# Altium schematic sheet KT1025A.SchDoc
size A4
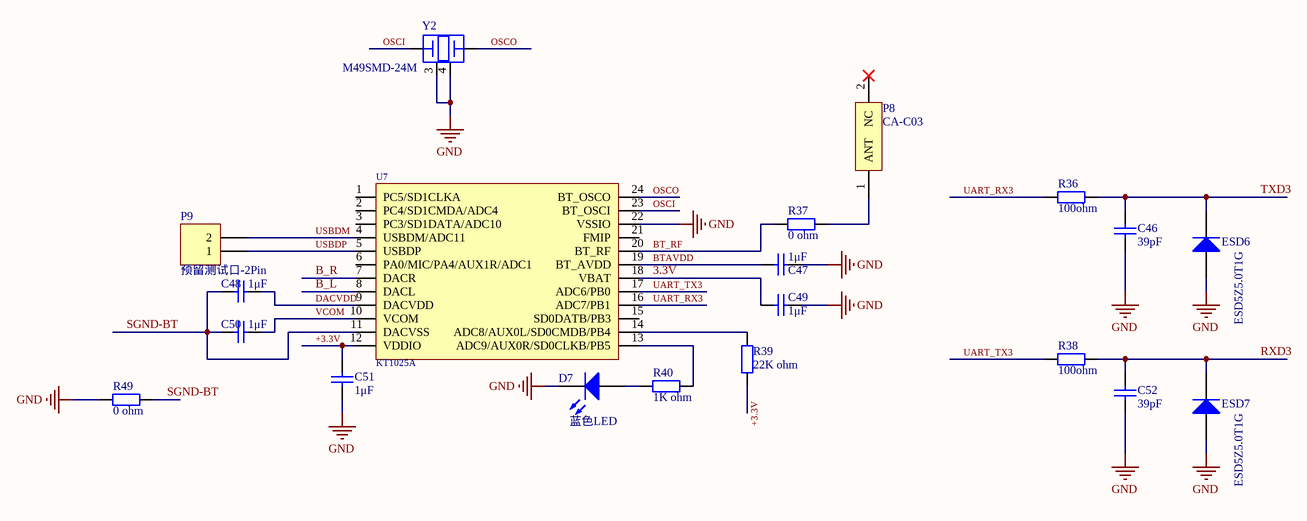
[diagram p0: KT1025A.SchDoc]

## Parts
C46  39pF  [0603C]
C47  1μF  [0603C]
C48  1μF  [0603C]
C49  1μF  [0603C]
C50  1μF  [0603C]
C51  1μF  [0603C]
C52  39pF  [0603C]
D7  蓝色LED  [0603LED]
ESD6  ESD5Z5.0T1G  [SOD523]
ESD7  ESD5Z5.0T1G  [SOD523]
P8  CA-C03  [ANT]
P9  预留测试口-2Pin  [预留测试口 2Pin]
R36  100ohm  [0603R]
R37  0 ohm  [0603R]
R38  100ohm  [0603R]
R39  22K ohm  [0603R]
R40  1K ohm  [0603R]
R49  0 ohm  [0805R]
U7  KT1025A  [SSOP24]
Y2  M49SMD-24M  [M49S]

## Nets
GND: C46.1 C47.2 C49.2 C51.1 C52.1 D7.2(K) ESD6.1(A) ESD7.1(A) R49.1 U7.22(VSSIO) Y2.3 Y2.4
3.3V: C49.1 U7.18(VBAT)
+3.3V: C51.2 R39.1 U7.12(VDDIO)
B_L: U7.8(DACL)
B_R: U7.7(DACR)
BT_RF: R37.1 U7.20(BT_RF)
BTAVDD: C47.1 U7.19(BT_AVDD)
DACVDD: C48.2 U7.9(DACVDD)
OSCI: U7.23(BT_OSCI) Y2.1
OSCO: U7.24(BT_OSCO) Y2.2
RXD3: C52.2 ESD7.2(K) R38.2
SGND-BT: C48.1 C50.1 R49.2 U7.11(DACVSS)
TXD3: C46.2 ESD6.2(K) R36.2
UART_RX3: R36.1 U7.16(ADC7/PB1)
UART_TX3: R38.1 U7.17(ADC6/PB0)
USBDM: P9.2 U7.4(USBDM/ADC11)
USBDP: P9.1 U7.5(USBDP)
VCOM: C50.2 U7.10(VCOM)
NetD7_1: D7.1(A) R40.2
NetP8_1: P8.1(ANT) R37.2
NetR39_2: R39.2 U7.14(ADC8/AUX0L/SD0CMDB/PB4)
NetR40_1: R40.1 U7.13(ADC9/AUX0R/SD0CLKB/PB5)

Not connected (* = marked no-connect by the designer): P8 2(NC)*; U7 1(PC5/SD1CLKA) 2(PC4/SD1CMDA/ADC4) 3(PC3/SD1DATA/ADC10) 6(PA0/MIC/PA4/AUX1R/ADC1) 15(SD0DATB/PB3) 21(FMIP)

## Library data of the parts
C46 C52 = Cap_39pF_50V_0603: 39pF_50V,C0G (EIA),±1%; 物料名称: 贴片陶瓷电容; 制造商: muRata; 物料编码: NA; 物料型号: GCM1885C1H390FA16; 单位: PCS; 物料规格: 39pF_50V,C0G (EIA),±1%
C47-C51 = Cap_1μF_50V_0603: 1μF_50V,X5R,±10%; 物料名称: 贴片陶瓷电容; 制造商: muRata; 物料编码: TCC0040; 物料型号: GRM188R61H105KAALD; 单位: PCS; 物料规格: 1μF_50V,X5R,±10%
D7 = 蓝色LED: 物料规格: LED(蓝色）; 制造商: VISHAY; 物料编码: TRG0035; 物料型号: TLMB1100; 单位: PCS; 物料名称: LED(蓝色）
ESD6 ESD7 = ESD5Z5.0T1G_SOD523: 物料名称: ESD二极管; 制造商: 安森美; 物料编码: NA; 单位: PCS; 物料规格: ESD5Z5.0T1G; 物料型号: ESD5Z5.0T1G
P8 = CA-C03: 物料名称: 蓝牙天线; 制造商: 寒武纪电子; 物料编码: NA; 单位: PCS; 物料规格: CA-C03; 物料型号: CA-C03
P9 = 预留测试口-2Pin: 制造商: NA; 单位: PCS; 物料规格: 预留测试口-2Pin; 物料名称: 预留测试口-2Pin; 物料编码: NA; 物料型号: 预留测试口-2Pin
R36 R38 = Res_100ohm_0603: 100 ohm_5%; 物料名称: 贴片电阻; 制造商: YAGEO; 物料编码: TRS0010; 物料型号: RC0603JR-07100R; 单位: PCS; 物料规格: 100 ohm_5%
R37 = Res_0 ohm_0603: 0 ohm,5%; 物料名称: 贴片电阻; 制造商: YAGEO; 物料编码: TRS0003; 物料型号: RC0603JR-070RL; 单位: PCS; 物料规格: 0 ohm,5%
R39 = Res_22K ohm_0603: 22K ohm,1%; 物料名称: 贴片电阻; 制造商: YAGEO; 物料编码: NA; 物料型号: RC0603FR-0722KL; 单位: PCS; 物料规格: 22K ohm,1%
R40 = Res_1K ohm_0603: 1K ohm,1%; 物料名称: 贴片电阻; 制造商: YAGEO; 物料编码: TRS0043; 物料型号: RC0603FR-071KL; 单位: PCS; 物料规格: 1K ohm,1%
R49 = Res_0 ohm_0805: 0 ohm,5%; 物料名称: 贴片电阻; 制造商: YAGEO; 物料编码: NA; 物料型号: RC0805JR-070RL; 单位: PCS; 物料规格: 0 ohm,5%
U7 = KT1025A: 物料名称: 蓝牙芯片; 单位: PCS; 物料编码: NA; 制造商: 深圳市清月电子（珠海杰里）; 物料规格: KT1025A; 物料型号: KT1025A
Y2 = M49SMD-24M-10ppm: 物料规格: M49SMD晶振24M; 物料名称: 晶振; 制造商: NA; 单位: PCS; 物料编码: NA; 物料型号: M49SMD晶振24M